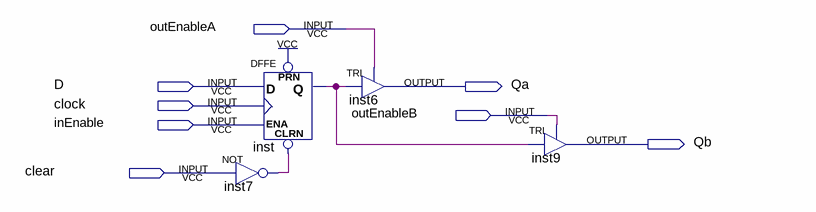
[diagram p0: schematic sheet]
// Quartus schematic register1bit.bdf as structural Verilog: 4 symbols, 8 pins
module register1bit (
  input  outEnableA,
  input  D,
  input  clock,
  input  outEnableB,
  input  inEnable,
  input  clear,
  output Qa,
  output Qb
);

  wire inst7_out, inst_q;

  DFFE inst (.PRN(1'b1), .CLRN(inst7_out), .D(D), .CLK(clock), .ENA(inEnable), .Q(inst_q));
  not inst7 (inst7_out, clear);
  TRI inst6 (.IN(inst_q), .OE(outEnableA), .OUT(Qa));
  TRI inst9 (.IN(inst_q), .OE(outEnableB), .OUT(Qb));
endmodule
